# Altium schematic sheet CAN.SchDoc: CAN
size A4; Author: Johan Vårlid; Revision: 1; SheetNumber: 2; SheetTotal: 3
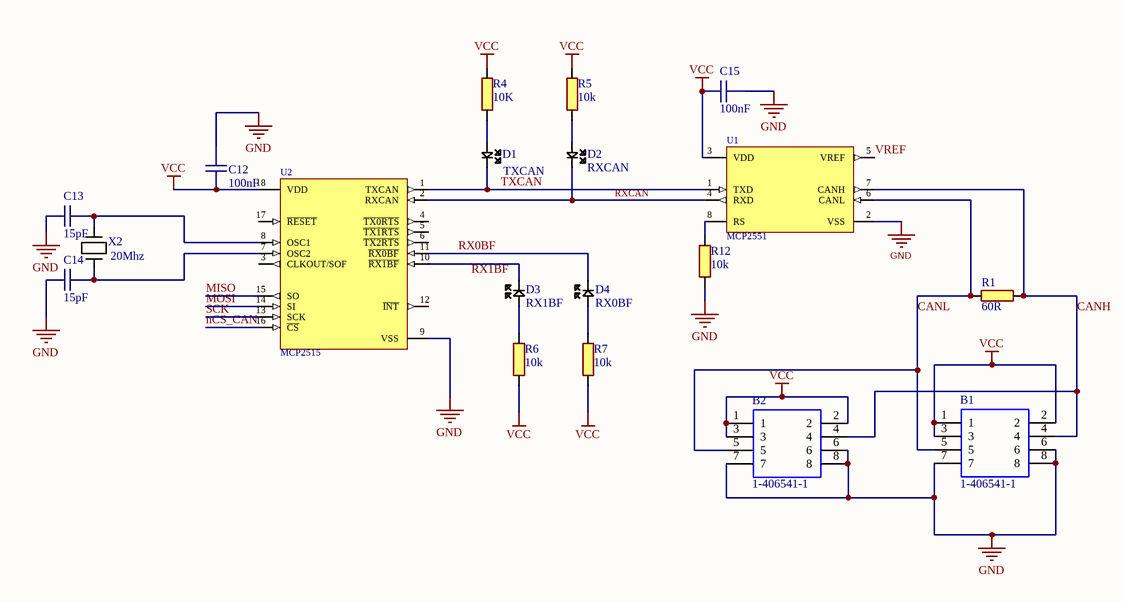
[diagram p0: CAN.SchDoc]

## Parts
B1  1-406541-1  [1-406541-1_1]
B2  1-406541-1  [1-406541-1_1]
C12  100nF  [CAPC0603(1608)55_N]
C13  15pF  [CAPC0603(1608)55_N]
C14  15pF  [CAPC0603(1608)55_N]
C15  100nF  [CAPC0603(1608)55_N]
D1  TXCAN  [I_LEDC0603(1608)_N]
D2  RXCAN  [I_LEDC0603(1608)_N]
D3  RX1BF  [I_LEDC0603(1608)_N]
D4  RX0BF  [I_LEDC0603(1608)_N]
R1  60R  [RESC0603(1608)_N]
R4  10K  [RESC0603(1608)_N]
R5  10k  [RESC0603(1608)_N]
R6  10k  [RESC0603(1608)_N]
R7  10k  [RESC0603(1608)_N]
R12  10k  [RESC0603(1608)_N]
U1  MCP2551  [SOIC127P590X363-8N]
U2  MCP2515  [SOIC127P940X265-18N]
X2  20Mhz  [CrystalTH]

## Nets
GND: B1.6 B1.7 B1.8 B2.6 B2.7 B2.8 C12.1 C13.1 C14.1 C15.2 R12.1 U1.2(VSS) U2.9(VSS)
VCC: B1.1 B1.2 B1.3 B2.1 B2.2 B2.3 C12.2 C15.1 R4.2 R5.2 R6.1 R7.1 U1.3(VDD) U2.18(VDD)
CANH: B1.4 B2.4 R1.1 U1.7(CANH)
CANL: B1.5 B2.5 R1.2 U1.6(CANL)
MISO: U2.15(SO)
MOSI: U2.14(SI)
nCS_CAN: U2.16(~{CS})
RX0BF: D4.2 U2.11(~{RX0BF})
RXCAN: D2.2 U1.4(RXD) U2.2(RXCAN)
SCK: U2.13(SCK)
TXCAN: D1.2 U1.1(TXD) U2.1(TXCAN)
VREF: U1.5(VREF)
NetC13_2: C13.2 U2.8(OSC1) X2.1
NetC14_2: C14.2 U2.7(OSC2) X2.2
NetD1_1: D1.1 R4.1
NetD2_1: D2.1 R5.1
NetD3_1: D3.1 R6.2
NetD3_2: D3.2 U2.10(~{RX1BF})
NetD4_1: D4.1 R7.2
NetR12_2: R12.2 U1.8(RS)

Not connected (* = marked no-connect by the designer): U2 3(CLKOUT/SOF) 4(~{TX0RTS}) 5(~{TX1RTS}) 6(~{TX2RTS}) 12(~{INT}) 17(~{RESET})

## Notes on the sheet
- Labels drawn without touching a wire or pin: RX1BF
- Size:
- Date:
- Title:
- A3
- Revision:
- Sheet
- of
- Author:
- File:

## Library data of the parts
B1 B2 = 1-406541-1: ModJack,RightAngle,8Position,Cat5 TE Connectivity Female Cat5 RJ45 Connector, Right Angle, Through Hole Mount,; Allied_Number: 70042871; Geometry.Height: mm; Supplier_Name: RS; RS Part Number: 2508293174; Manufacturer_Name: TE Connectivity; Manufacturer_Part_Number: 1-406541-1; Other Part Number: *; Datasheet Link: http://uk.rs-online.com/web/p/products/7820823; 3D Package: *
C12 C15 = 3028: X7R 50V 5%; id: 3028; pakke_opprettet_av: 815; pakke_opprettet: 18.02.2015 14.18.13; symbol_opprettet: 14.11.2014 20.19.34; leverandor_varenr: 1759122; pris: 1; nokkelord: Kondensator, Capacitor, CAP; produsent: Multikomp; leverandor: Farnell; pakketype: 0603; symbol_opprettet_av: 815; navn: 100nF
C13 C14 = 3026: NP0 50V 5%; id: 3026; pakke_opprettet_av: 815; pakke_opprettet: 18.02.2015 14.18.13; symbol_opprettet: 14.11.2014 20.19.34; leverandor_varenr: 1865484; navn: 91pF; pris: 1; nokkelord: Kondensator, Capacitor, CAP; produsent: Kemet; leverandor: Farnell; pakketype: 0603; symbol_opprettet_av: 815
D1-D4 = 2208: id: 2208; rad: 0; rom: OV; lager_type: Fremlager; dybde: 1; hylle: 6; antall: 200; pakke_opprettet_av: 815; pakke_opprettet: 06.07.2014 18.55.44; symbol_opprettet: 06.07.2014 18.59.47; beskrivelse: SMD; leverandor_varenr: 2251459; navn: SMD LED Blue; nokkelord: diode, led, lys, blå; produsent: Vishay; leverandor: Farnell; pakketype: 0603; kolonne: 0; symbol_opprettet_av: 815; pris: 1
R1 = 3421: 0.1W 1% Thick film resistor; id: 3421; rad: -1; rom: OV; lager_type: Fremlager; dybde: 29; hylle: 3; antall: 100; kolonne: 0; pakke_opprettet_av: 815; pakketype: 0603; pakke_opprettet: 08.07.2014 21:15:30; symbol_opprettet_av: 815; symbol_opprettet: 08.07.2014 21:16:33; navn: 60R; pris: 0
R4-R7 R12 = 2444: 0.1W 1% Thick film resistor; id: 2444; rad: 21; rom: GM; lager_type: Baklager; dybde: 1; hylle: 0; antall: 3500; pakke_opprettet_av: 815; pakke_opprettet: 08.07.2014 21.15.30; symbol_opprettet: 08.07.2014 21.16.33; leverandor_varenr: 2447230; nokkelord: Resistor Motstand; produsent: Multikomp; leverandor: Farnell; pakketype: 0603; kolonne: 0; symbol_opprettet_av: 815; navn: 10k; pris: 0
U1 = 2049: CAN TRANCEIVER; id: 2049; pakke_opprettet_av: 774; symbol_opprettet_av: 815; pris: 14; pakketype: SMD; pakke_opprettet: 23.08.2014 14:54:32; symbol_opprettet: 15.11.2014 15:34:47; navn: MCP2551
U2 = 2048: CAN CONTROLLER; id: 2048; pakke_opprettet_av: 815; pakke_opprettet: 15.11.2014 16.05.26; symbol_opprettet: 15.11.2014 15.35.25; pris: 18; pakketype: SMD; symbol_opprettet_av: 815; navn: MCP2515
X2 = 3915: id: 3915; rad: 0; rom: OV; lager_type: Fremlager; hylle: 7; antall: 30; kolonne: 1; pakke_opprettet_av: 1150; pakke_opprettet: 29.01.2017 21.01.52; symbol_opprettet_av: 774; symbol_opprettet: 23.08.2014 20.23.20; navn: Krystalloscillator; pris: 2; nokkelord: krystall, crystal, oscillator; pakketype: TH; dybde: 0